# EAGLE design utp_splitter (EAGLE 9.5.1)
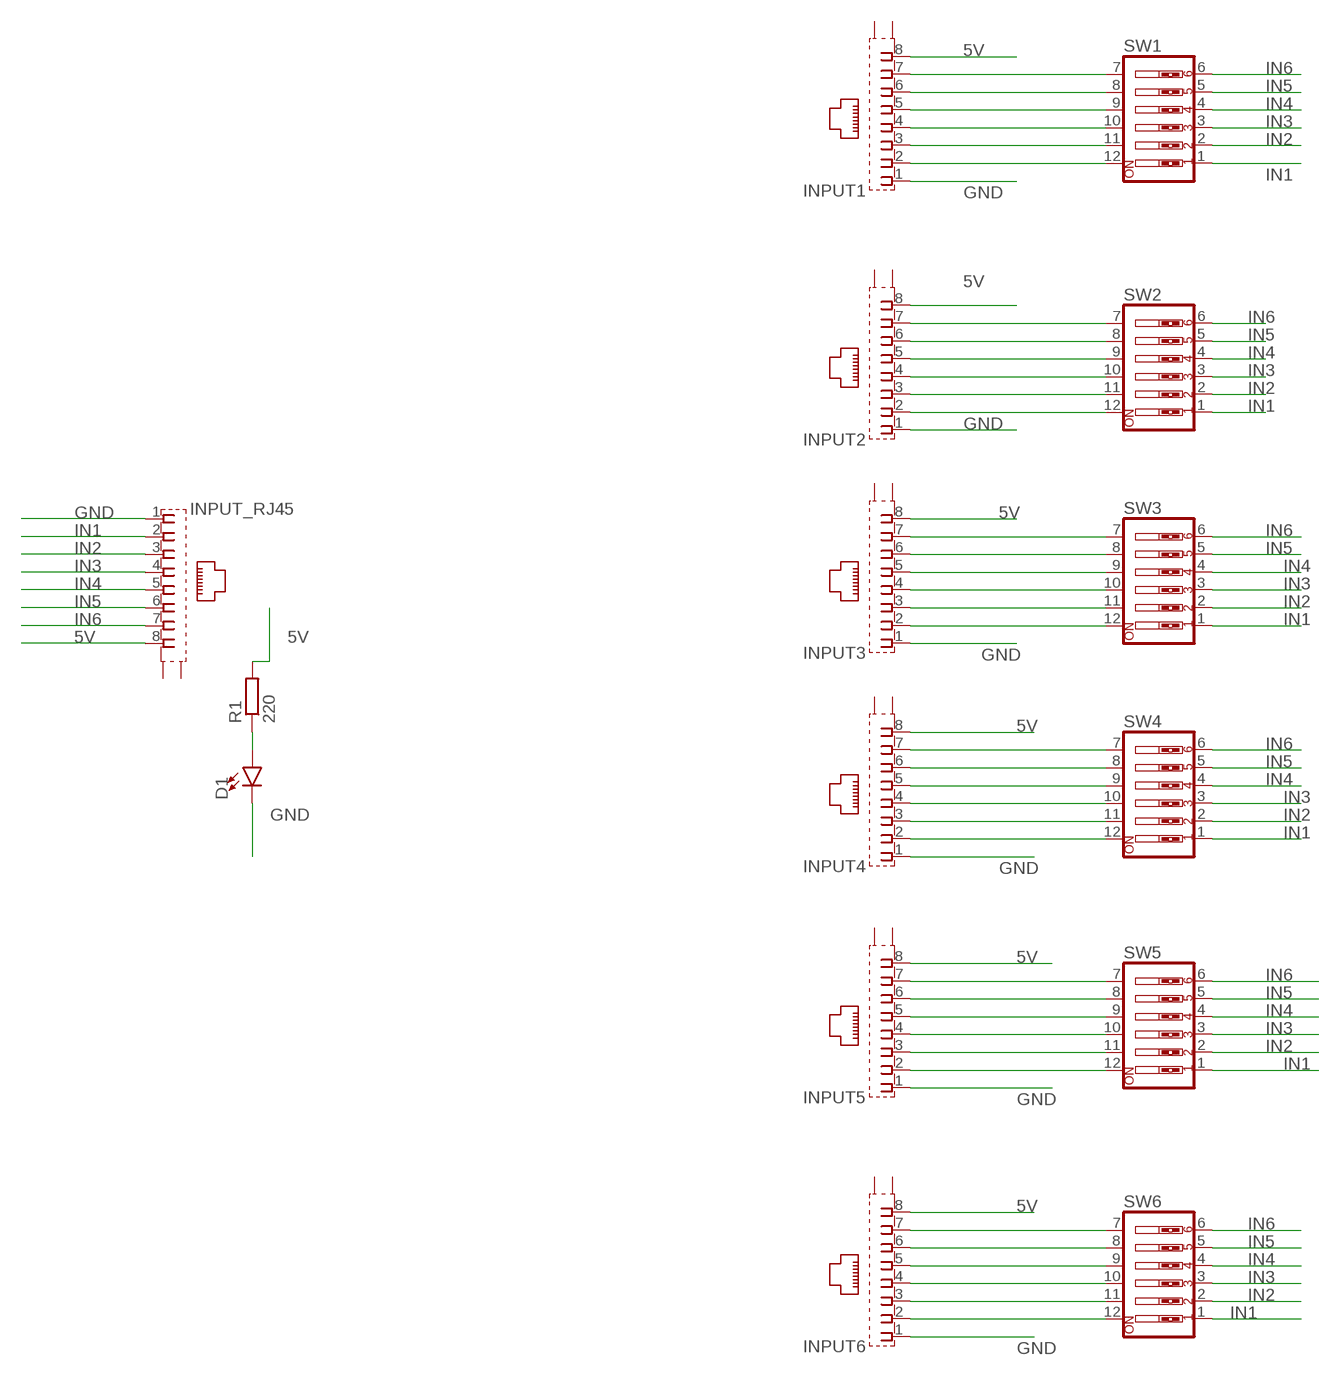
[diagram p0: schematic, sheet 1]

## Parts
D1  LED-5MM-KIT-NO-SILK  [LED_5MM-KIT-NO-SILK]
INPUT1  GLX-S-88M  [GLX-S-88M]
INPUT2  GLX-S-88M  [GLX-S-88M]
INPUT3  GLX-S-88M  [GLX-S-88M]
INPUT4  GLX-S-88M  [GLX-S-88M]
INPUT5  GLX-S-88M  [GLX-S-88M]
INPUT6  GLX-S-88M  [GLX-S-88M]
INPUT_RJ45  GLX-S-88M  [GLX-S-88M]
R1  220  R-EU_0207/10  [0207/10]
SW1  SW_DIP-6  [EDG-06]
SW2  SW_DIP-6  [EDG-06]
SW3  SW_DIP-6  [EDG-06]
SW4  SW_DIP-6  [EDG-06]
SW5  SW_DIP-6  [EDG-06]
SW6  SW_DIP-6  [EDG-06]

## Nets
5V: INPUT1.8 INPUT2.8 INPUT3.8 INPUT4.8 INPUT5.8 INPUT6.8 INPUT_RJ45.8 R1.2
GND: D1.K(C) INPUT1.1 INPUT2.1 INPUT3.1 INPUT4.1 INPUT5.1 INPUT6.1 INPUT_RJ45.1
IN1: INPUT_RJ45.2 SW1.1 SW2.1 SW3.1 SW4.1 SW5.1 SW6.1
IN2: INPUT_RJ45.3 SW1.2 SW2.2 SW3.2 SW4.2 SW5.2 SW6.2
IN3: INPUT_RJ45.4 SW1.3 SW2.3 SW3.3 SW4.3 SW5.3 SW6.3
IN4: INPUT_RJ45.5 SW1.4 SW2.4 SW3.4 SW4.4 SW5.4 SW6.4
IN5: INPUT_RJ45.6 SW1.5 SW2.5 SW3.5 SW4.5 SW5.5 SW6.5
IN6: INPUT_RJ45.7 SW1.6 SW2.6 SW3.6 SW4.6 SW5.6 SW6.6
N$2: INPUT6.7 SW6.7
N$3: INPUT6.6 SW6.8
N$4: INPUT6.5 SW6.9
N$5: INPUT6.4 SW6.10
N$6: INPUT6.3 SW6.11
N$7: INPUT6.2 SW6.12
N$9: D1.A R1.1
N$10: INPUT1.7 SW1.7
N$11: INPUT1.6 SW1.8
N$12: INPUT1.5 SW1.9
N$13: INPUT1.4 SW1.10
N$14: INPUT1.3 SW1.11
N$15: INPUT1.2 SW1.12
N$18: INPUT2.7 SW2.7
N$19: INPUT2.6 SW2.8
N$20: INPUT2.5 SW2.9
N$21: INPUT2.4 SW2.10
N$22: INPUT2.3 SW2.11
N$23: INPUT2.2 SW2.12
N$26: INPUT3.7 SW3.7
N$27: INPUT3.6 SW3.8
N$28: INPUT3.5 SW3.9
N$29: INPUT3.4 SW3.10
N$30: INPUT3.3 SW3.11
N$31: INPUT3.2 SW3.12
N$34: INPUT4.7 SW4.7
N$35: INPUT4.6 SW4.8
N$36: INPUT4.5 SW4.9
N$37: INPUT4.4 SW4.10
N$38: INPUT4.3 SW4.11
N$39: INPUT4.2 SW4.12
N$42: INPUT5.7 SW5.7
N$43: INPUT5.6 SW5.8
N$44: INPUT5.5 SW5.9
N$45: INPUT5.4 SW5.10
N$46: INPUT5.3 SW5.11
N$47: INPUT5.2 SW5.12
Unconnected: INPUT1.S1 INPUT1.S2 INPUT2.S1 INPUT2.S2 INPUT3.S1 INPUT3.S2 INPUT4.S1 INPUT4.S2 INPUT5.S1 INPUT5.S2 INPUT6.S1 INPUT6.S2 INPUT_RJ45.S1 INPUT_RJ45.S2

## Library data of the parts
D1 = SparkFun-LED:LED: LED (Generic) Standard schematic elements and footprints for 5mm, 3mm, 1206, and 0603 sized LEDs. Generic LEDs with no color specified.
INPUT1-INPUT6 INPUT_RJ45 = con-kycon:GLX-S-88M: Mod. Jack, Right Angle, 8 posiotion, 8 contatcs RJ45 Source: GLX-S-88M.pdf; OC_FARNELL: unknown; OC_NEWARK: unknown
R1 = rcl:R-EU_: RESISTOR, European symbol; SPICEPREFIX: R
SW1-SW6 = special:SW_DIP-6: DIP SWITCH

## Board
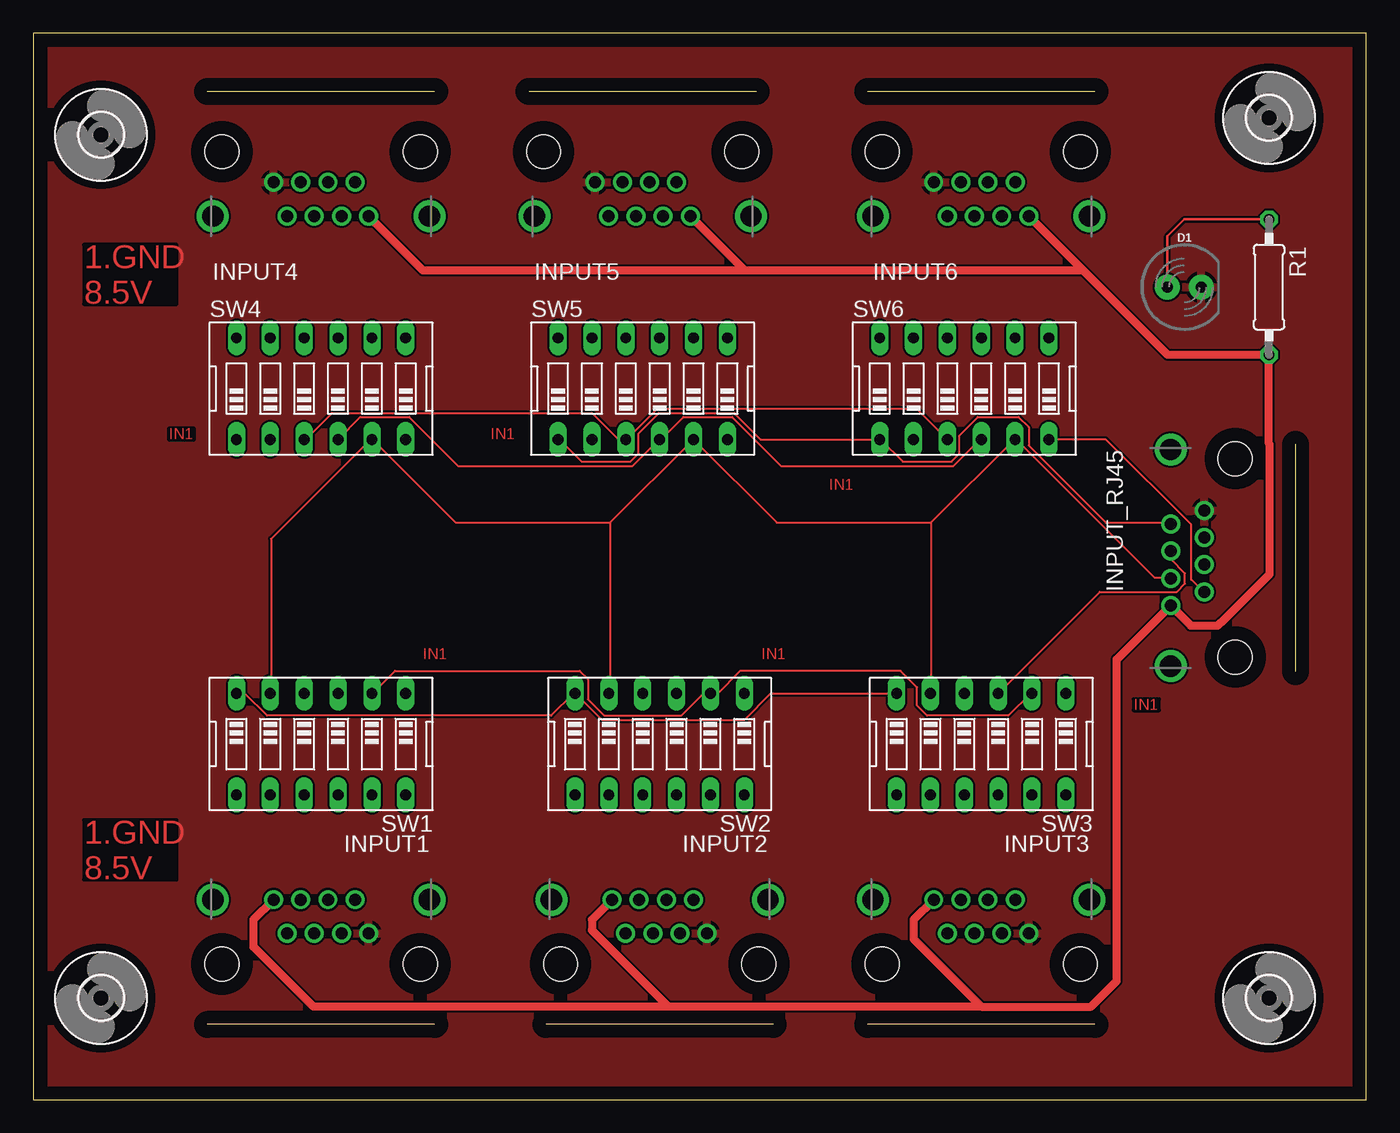
[diagram p1: board, top side]
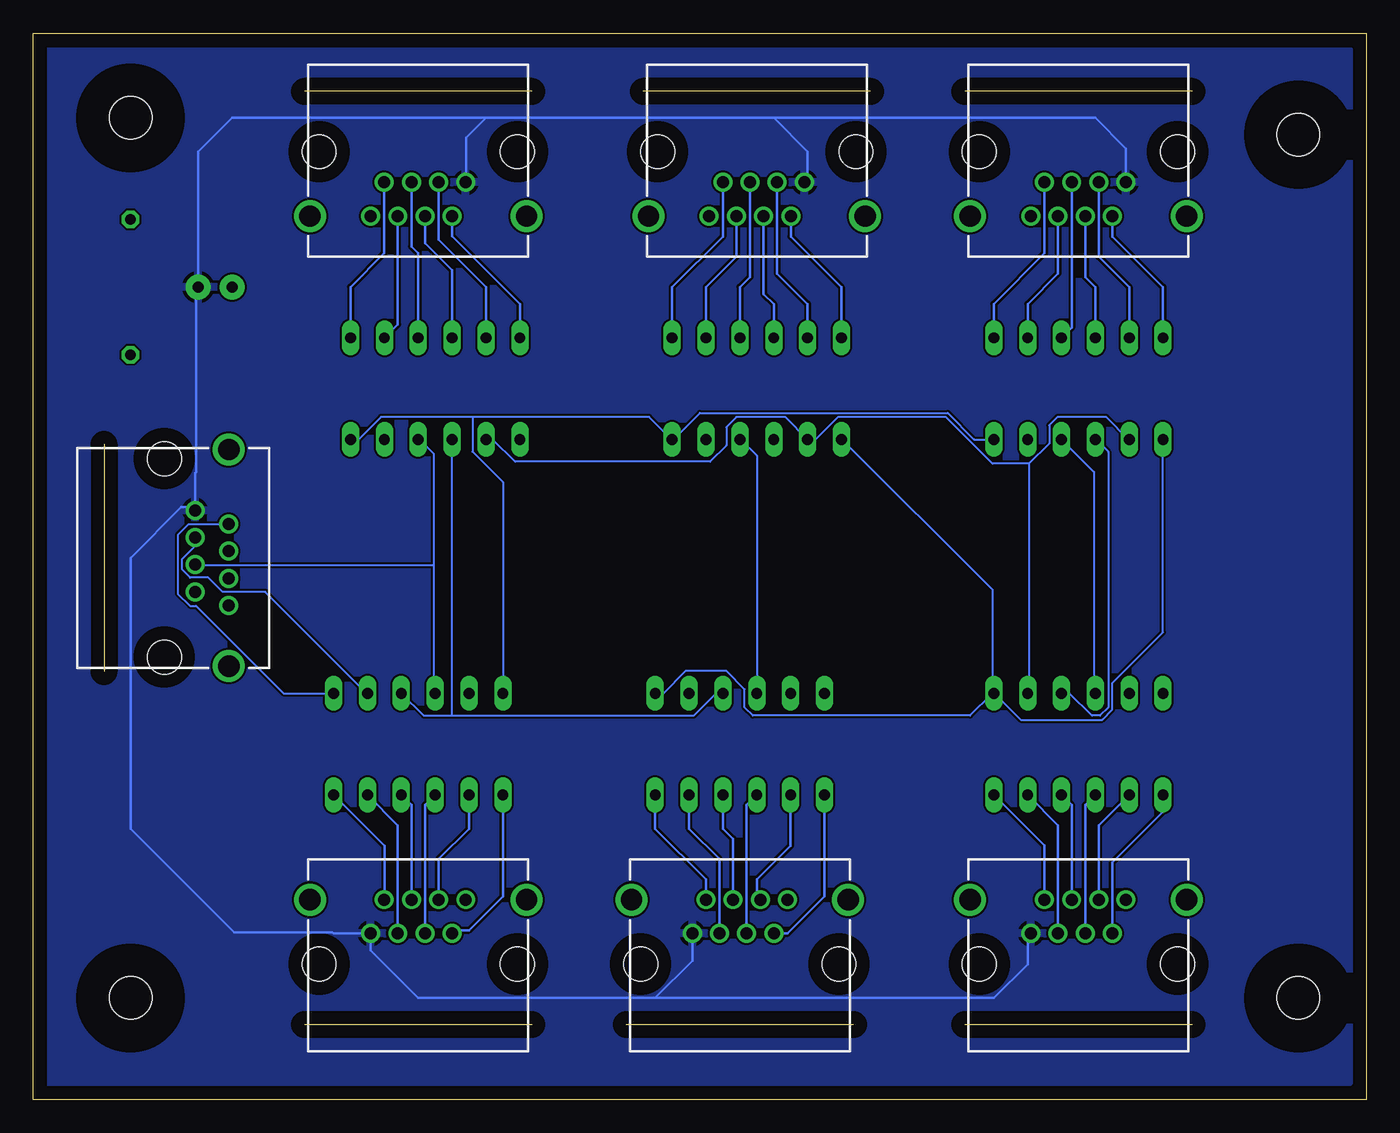
[diagram p2: board, bottom side, seen from below]

Size 100 x 80 mm. Coordinates in mm from the lower left corner, seen from the top.
Outline: 0,0 100,0 100,80 0,80 0,0
Copper layers (1*16): Top 0.035mm / dielectric 1.5mm / Bottom 0.035mm
Design rules "default": minimum track width 6mil, minimum drill 0.35mm, track to track 6mil, track to pad 6mil, pad to pad 6mil, via to via 6mil, smd to smd 6mil, copper to edge 40mil, drill to drill 6mil, minimum pad ring 10mil, minimum via ring 8mil, stop-mask expansion 4mil, vias tented up to drill 0mil, thermal gap 10mil

### Footprints (pad centres in the part's own frame; a part is rotated, then mirrored left to right if it is on the bottom)
LED_5MM-KIT-NO-SILK = drill 0.813 pad 1.88: A -1.27,0; K 1.27,0
GLX-S-88M = drill 0.9 pad 1.422: 1 -3.57,-2.3; 2 -2.55,-4.84; 3 -1.53,-2.3; 4 -0.51,-4.84; 5 0.51,-2.3; 6 1.53,-4.84; 7 2.55,-2.3; 8 3.57,-4.84 | drill 1.6 pad 2.184: S1 -8.125,-4.84; S2 8.125,-4.84 | hole 2.55: -7.44,0; 7.44,0
0207/10 = drill 0.813 octagon: 1 -5.08,0; 2 5.08,0
EDG-06 = drill 0.813 long: 1 -6.35,-3.81; 2 -3.81,-3.81; 3 -1.27,-3.81; 4 1.27,-3.81; 5 3.81,-3.81; 6 6.35,-3.81; 7 6.35,3.81; 8 3.81,3.81; 9 1.27,3.81; 10 -1.27,3.81; 11 -3.81,3.81; 12 -6.35,3.81
3,2 = hole 3.2: 0,0

### Placement (x,y rotation side)
D1  86.36,60.96 0 top
INPUT1  21.59,10.16 180 top
INPUT2  46.99,10.16 180 top
INPUT3  71.12,10.16 180 top
INPUT4  21.59,71.12 0 top
INPUT5  45.72,71.12 0 top
INPUT6  71.12,71.12 0 top
INPUT_RJ45  90.17,40.64 270 top
R1  92.71,60.96 270 top
SW1  21.59,26.67 180 top
SW2  46.99,26.67 180 top
SW3  71.12,26.67 180 top
SW4  21.59,53.34 0 top
SW5  45.72,53.34 0 top
SW6  69.85,53.34 0 top
U$1  [3,2]  92.71,73.66 0 top
U$2  [3,2]  92.71,7.62 0 top
U$3  [3,2]  5.08,72.39 0 top
U$4  [3,2]  5.08,7.62 0 top

### Tracks (layer width: path | path; a pad name or v marks a point on that pad's centre or on a via)
5V
  Top 0.61: INPUT3.8 66.04,13.49 66.04,12.04 71.12,6.96 | 71.12,6.96 79.35,6.96 81.28,8.89 81.28,33.02 INPUT_RJ45.8 86.84,35.56 88.86,35.56 89.09,35.8 89.14,35.8 92.77,39.43 92.77,49.16 92.71,49.21 R1.2 85.09,55.88 78.74,62.23 | INPUT2.8 41.91,13.49 41.91,12.7 47.65,6.96 | 71.12,6.96 47.65,6.96 | 47.65,6.96 21.02,6.96 16.53,11.45 16.53,13.51 INPUT1.8 | INPUT5.8 53.34,62.23 | INPUT4.8 29.21,62.23 53.34,62.23 | 53.34,62.23 78.74,62.23 | INPUT6.8 78.74,62.23
GND
  Bottom 0.203: 53.34,7.62 71.12,7.62 74.69,11.19 INPUT3.1 77.48,12.46 77.57,12.55 84.94,12.55 92.71,20.32 92.71,40.64 88.9,44.45 87.87,44.45 | INPUT2.1 50.56,10.4 53.34,7.62 | INPUT1.1 25.4,12.22 25.4,10.16 27.94,7.62 53.34,7.62 | INPUT6.1 67.55,72.15 66.04,73.66 | 66.04,73.66 44.45,73.66 | 44.45,73.66 41.91,71.12 41.91,69.06 INPUT5.1 | INPUT4.1 18.02,71.36 20.32,73.66 44.45,73.66 | 66.04,73.66 85.09,73.66 87.63,71.12 D1.K 87.78,60.81 87.78,47.09 87.87,47 87.87,44.45 | INPUT_RJ45.1 87.87,44.45
  pour Bottom: 99.06,78.74 1.27,78.74 1.27,1.27 99.06,1.27
  pour Top: 99.06,78.74 1.27,78.74 1.27,0 97.79,0 99.06,1.27
IN1
  Top 0.152: SW5.1 39.47,49.53 41.15,47.85 44.81,47.85 45.41,48.46 45.41,49.99 46.94,51.51 52.58,51.51 54.56,49.53 SW6.1 63.55,49.53 65.23,47.85 68.89,47.85 69.49,48.46 69.49,49.84 70.87,51.21 73.91,51.21 74.68,50.44 74.68,49.07 80.47,43.28 85.19,43.28 INPUT_RJ45.2
  Bottom 0.152: SW3.1 81.23,30.48 87.78,37.03 88.24,37.03 89.15,37.95 89.15,42.37 88.39,43.13 85.34,43.13 INPUT_RJ45.2 | 28.04,30.48 28.04,38.25 39.32,49.53 SW5.1 | SW2.1 52.73,30.48 51.05,32.16 48.01,32.16 46.63,30.79 46.63,29.41 46.02,28.8 29.72,28.8 28.04,30.48 | 28.04,30.48 SW1.1 27.89,30.48 25.91,28.5 19.81,28.5 19.05,29.26 19.05,31.24 15.24,35.05 SW4.1
IN2
  Top 0.152: SW3.2 74.83,30.48 73.15,28.8 67.06,28.8 66.29,29.57 66.29,30.94 65.08,32.16 53.03,32.16 51.36,30.48 SW2.2 50.29,30.48 48.62,28.8 42.82,28.8 41.6,30.02 41.6,31.55 41,32.16 27.13,32.16 25.45,30.48 SW1.2
  Bottom 0.152: INPUT_RJ45.3 87.94,42.06 87.94,41.45 88.85,40.54 88.85,39.78 88.24,39.17 86.87,39.17 85.8,38.1 82.6,38.1 74.98,30.48 SW3.2 | 25.3,47.7 25.3,30.48 SW1.2 | 25.3,47.7 23.77,49.23 23.77,50.6 23.16,51.21 19.51,51.21 17.83,49.53 SW4.2 | 25.3,47.7 28.04,47.7 31.55,51.21 39.62,51.21 41.3,49.53 SW5.2 43.59,51.21 47.24,51.21 48.01,50.44 48.01,49.07 49.23,47.85 63.86,47.85 65.53,49.53 SW6.2
IN3
  Top 0.152: SW4.3 20.42,49.53 22.4,51.51 41.91,51.51 43.89,49.53 SW5.3 44.5,49.53 46.79,51.82 66.29,51.82 SW6.3 | SW3.3 80.01,38.1 85.8,38.1 86.41,38.71 86.41,39.47 85.34,40.54 85.34,41.15 INPUT_RJ45.4
  Bottom 0.152: SW1.3 22.25,30.48 20.57,28.8 19.96,28.8 19.36,29.41 19.36,48.62 20.27,49.53 SW4.3 | SW2.3 48.77,30.48 50.44,28.8 68.58,28.8 | 68.58,28.8 70.71,28.8 SW3.3 | 68.58,28.8 SW6.3
IN4
  Top 0.152: SW4.4 24.54,51.21 28.19,51.21 31.85,47.55 44.96,47.55 46.94,49.53 SW5.4 47.09,49.53 48.77,51.21 52.43,51.21 56.08,47.55 69.04,47.55 71.02,49.53 SW6.4
  Bottom 0.152: 69.95,40.08 69.95,48.46 71.02,49.53 SW6.4 | 69.95,40.08 69.95,30.48 SW3.4 | 69.95,40.08 87.78,40.08 INPUT_RJ45.5 | SW2.4 45.72,48.31 46.94,49.53 SW5.4 | SW4.4 20.42,47.09 20.42,30.48 SW1.4
IN5
  Top 0.152: 67.36,43.28 67.36,30.48 SW3.5 | 67.36,43.28 73.61,49.53 SW6.5 73.76,49.53 84.12,39.17 85.19,39.17 INPUT_RJ45.6 | 43.28,43.28 43.28,30.48 SW2.5 | 43.28,43.28 SW5.5 55.78,43.28 67.36,43.28 | SW1.5 17.83,30.48 17.83,42.06 25.3,49.53 SW4.5 25.45,49.53 31.7,43.28 43.28,43.28
IN6
  Top 0.152: SW1.6 15.85,30.48 17.53,28.8 38.86,28.8 40.54,30.48 SW2.6 40.69,30.48 42.67,28.5 53.34,28.5 55.32,30.48 SW3.6 | SW6.6 80.47,49.53 86.87,43.13 86.87,39.01 87.78,38.1 INPUT_RJ45.7
  Bottom 0.152: SW4.6 29.41,49.53 31.39,51.51 49.99,51.51 51.97,49.53 SW5.6 52.12,49.53 53.8,51.21 67.06,51.21 | SW6.6 75.59,49.53 73.91,51.21 67.06,51.21 | SW3.6 64.77,46.33 67.06,48.62 67.06,51.21
N$2
  Bottom 0.203: INPUT6.7 73.67,63.49 76.2,60.96 SW6.7
N$3
  Bottom 0.203: SW6.8 72.65,58.16 INPUT6.6
N$4
  Bottom 0.203: INPUT6.5 71.63,64.01 71.12,63.5 SW6.9
N$5
  Bottom 0.203: INPUT6.4 70.61,64.26 68.58,62.23 SW6.10
N$6
  Bottom 0.203: INPUT6.3 69.59,64.51 66.04,60.96 SW6.11
N$7
  Bottom 0.203: SW6.12 63.5,59.69 68.58,64.77 INPUT6.2
N$9
  Top 0.203: D1.A 85.09,64.77 86.36,66.04 R1.1
N$10
  Bottom 0.203: INPUT1.7 19.04,17.79 15.24,21.59 SW1.7
N$11
  Bottom 0.203: INPUT1.6 20.06,20.58 SW1.8
N$12
  Bottom 0.203: INPUT1.5 21.08,22.1 SW1.9
N$13
  Bottom 0.203: INPUT1.4 22.1,22.1 SW1.10
N$14
  Bottom 0.203: INPUT1.3 23.12,20.58 SW1.11
N$15
  Bottom 0.203: INPUT1.2 24.14,19.06 SW1.12
N$18
  Bottom 0.203: INPUT2.7 43.42,12.46 40.64,15.24 SW2.7
N$19
  Bottom 0.203: INPUT2.6 45.72,15.26 45.72,16.51 43.18,19.05 SW2.8
N$20
  Bottom 0.203: INPUT2.5 46.48,22.1 SW2.9
N$21
  Bottom 0.203: INPUT2.4 47.5,19.56 48.26,20.32 SW2.10
N$22
  Bottom 0.203: INPUT2.3 48.52,18.04 50.8,20.32 SW2.11
N$23
  Bottom 0.203: INPUT2.2 49.54,16.52 53.34,20.32 SW2.12
N$26
  Bottom 0.203: INPUT3.7 68.33,12.7 67.31,12.7 64.77,15.24 SW3.7
N$27
  Bottom 0.203: INPUT3.6 69.59,18.04 67.31,20.32 SW3.8
N$28
  Bottom 0.203: INPUT3.5 70.61,22.1 SW3.9
N$29
  Bottom 0.203: INPUT3.4 71.63,22.1 SW3.10
N$30
  Bottom 0.203: INPUT3.3 72.65,20.58 SW3.11
N$31
  Bottom 0.203: SW3.12 73.66,19.05 INPUT3.2
N$34
  Bottom 0.203: INPUT4.7 24.14,63.49 27.94,59.69 SW4.7
N$35
  Bottom 0.203: INPUT4.6 23.12,61.97 25.4,59.69 SW4.8
N$36
  Bottom 0.203: INPUT4.5 22.1,57.91 SW4.9
N$37
  Bottom 0.203: INPUT4.4 21.08,61.72 20.32,60.96 SW4.10
N$38
  Bottom 0.203: INPUT4.3 20.06,63.24 17.78,60.96 SW4.11
N$39
  Bottom 0.203: INPUT4.2 19.04,64.76 15.24,60.96 SW4.12
N$42
  Bottom 0.203: INPUT5.7 48.27,64.76 52.07,60.96 SW5.7
N$43
  Bottom 0.203: INPUT5.6 47.25,63.24 49.53,60.96 SW5.8
N$44
  Bottom 0.203: INPUT5.5 46.23,61.72 46.99,60.96 SW5.9
N$45
  Bottom 0.203: INPUT5.4 45.21,60.45 44.45,59.69 SW5.10
N$46
  Bottom 0.203: INPUT5.3 44.19,61.97 41.91,59.69 SW5.11
N$47
  Bottom 0.203: INPUT5.2 43.17,64.76 39.37,60.96 SW5.12

### Text on the board
Top: 1.GND / 8.5V | IN1 | IN1 | IN1 | IN1 | IN1 | IN1 | 1.GND / 8.5V